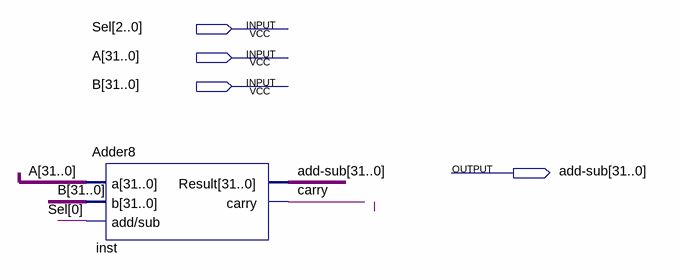
[diagram p0: schematic sheet]
// Quartus schematic ALU.bdf as structural Verilog: 1 symbols, 4 pins
module ALU (
  input  [2:0] Sel,
  input  [31:0] A,
  input  [31:0] B,
  output [31:0] \add-sub 
);

  wire carry;

  Adder8 inst (.a(A), .b(B), .\add/sub (Sel[0]), .Result(\add-sub ), .carry(carry));
endmodule
